# Altium schematic sheet 4_shkb_downstream_power.SchDoc: =ProjectTitle
size A4; Address1: github.com/4pplet/SHKB; Address2: Licence: CERN-OHL-S; SheetNumber: 4; SheetTotal: 7
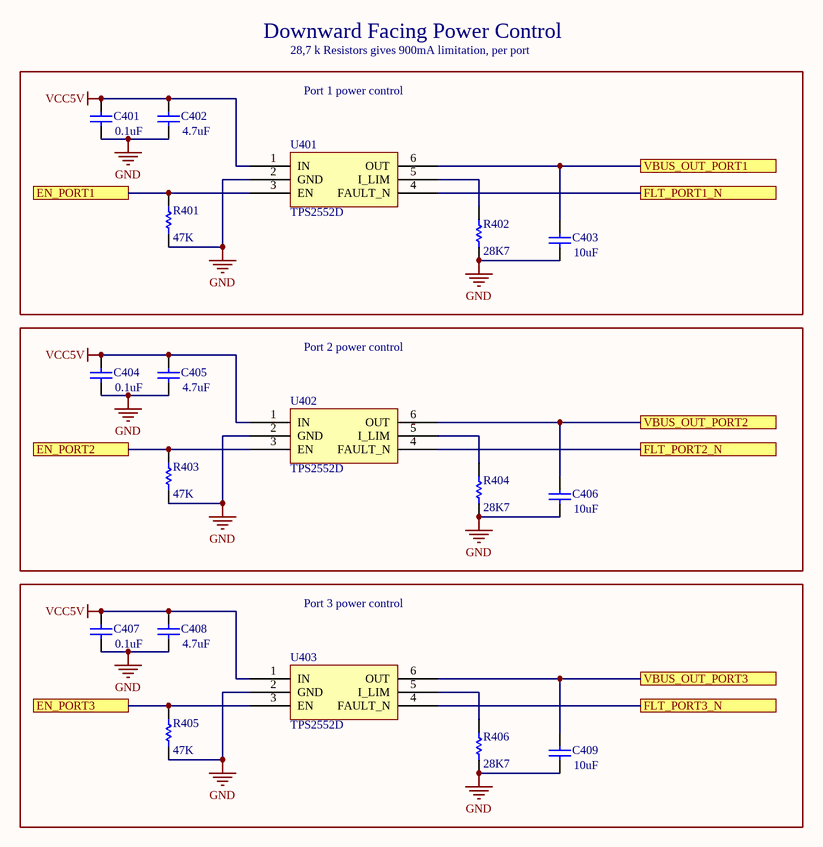
[diagram p0: 4_shkb_downstream_power.SchDoc]

## Parts
C401  value 0.1uF  [C0603[1608]]
C402  value 4.7uF  [C1206[3216]]
C403  value 10uF  [C1206[3216]]
C404  value 0.1uF  [C0603[1608]]
C405  value 4.7uF  [C1206[3216]]
C406  value 10uF  [C1206[3216]]
C407  value 0.1uF  [C0603[1608]]
C408  value 4.7uF  [C1206[3216]]
C409  value 10uF  [C1206[3216]]
R401  value 47K  [R0603[1608]]
R402  value 28K7  [R0603[1608]]
R403  value 47K  [R0603[1608]]
R404  value 28K7  [R0603[1608]]
R405  value 47K  [R0603[1608]]
R406  value 28K7  [R0603[1608]]
U401  TPS2552D  [SOT-23-6]
U402  TPS2552D  [SOT-23-6]
U403  TPS2552D  [SOT-23-6]

## Blocks framed on the sheet
Port 2 power control: C404-C406 R403 R404 U402
Port 3 power control: C407-C409 R405 R406 U403

## Ports
EN_PORT1, EN_PORT2, EN_PORT3, FLT_PORT1_N, FLT_PORT2_N, FLT_PORT3_N, VBUS_OUT_PORT1, VBUS_OUT_PORT2, VBUS_OUT_PORT3

## Nets
GND: C401.1 C402.1 C403.1 C404.1 C405.1 C406.1 C407.1 C408.1 C409.1 R401.2 R402.2 R403.2 R404.2 R405.2 R406.2 U401.2(GND) U402.2(GND) U403.2(GND)
VCC5V: C401.2 C402.2 C404.2 C405.2 C407.2 C408.2 U401.1(IN) U402.1(IN) U403.1(IN)
EN_PORT1: R401.1 U401.3(EN) ; port EN_PORT1
EN_PORT2: R403.1 U402.3(EN) ; port EN_PORT2
EN_PORT3: R405.1 U403.3(EN) ; port EN_PORT3
FLT_PORT1_N: U401.4(FAULT_N) ; port FLT_PORT1_N
FLT_PORT2_N: U402.4(FAULT_N) ; port FLT_PORT2_N
FLT_PORT3_N: U403.4(FAULT_N) ; port FLT_PORT3_N
VBUS_OUT_PORT1: C403.2 U401.6(OUT) ; port VBUS_OUT_PORT1
VBUS_OUT_PORT2: C406.2 U402.6(OUT) ; port VBUS_OUT_PORT2
VBUS_OUT_PORT3: C409.2 U403.6(OUT) ; port VBUS_OUT_PORT3
NetR402_1: R402.1 U401.5(I_LIM)
NetR404_1: R404.1 U402.5(I_LIM)
NetR406_1: R406.1 U403.5(I_LIM)

## Notes on the sheet
- Downward Facing Power Control
- 28,7 k Resistors gives 900mA limitation, per port
- Port 1 power control
- Title
- Size:
- Date:
- A4
- Number:
- Time:
- Revision:
- Sheet
- of
- File:

## Library data of the parts
C401 C404 C407 = Cap: Capacitor; MRF.Part: CC0603KRX7R9BB104; MFG: KEMET; MFGPN: C0603C104M5RACTU; LCSC MFG: YAGEO; Version: 0603 imperial; JLC: BASIC; LCSC Part #: C14663
C402 C405 C408 = Cap: Capacitor; MRF.Part: 1206B475K500NT; MFG: KEMET; MFGPN: C1206C475K4PACTU; LCSC MFG: Guangdong Fenghua Advanced Tech; Version: 1206 imperial; JLC: BASIC; LCSC Part #: C29823
C403 C406 C409 = Cap: Capacitor; MRF.Part: CL31A106KBHNNNE; MFG: KEMET; MFGPN: C1206C106K4PACTU; LCSC MFG: Samsung Electro-Mechanics; Version: 1206 imperial; JLC: BASIC; LCSC Part #: C13585
R401 R403 R405 = Res1: Resistor; MRF.Part: 0603WAF4702T5E; MFG: Vishay Dale; MFGPN: RCA060347K0FKEA; LCSC MFG: Uniroyal Elec; Version: 0603 imperial; JLC: BASIC; LCSC Part #: C25819
R402 R404 R406 = Res1: Resistor; MRF.Part: ERA3AEB2872V; LCSC MFG: PANASONIC; Version: 0603 imperial; JLC: BASIC; LCSC Part #: C491124
U401-U403 = TPS2552D: MRF.Part: TPS2552DBVR-1; LCSC MFG: Texas Instruments; LCSC Part #: C140331; JLC: EXTENDED